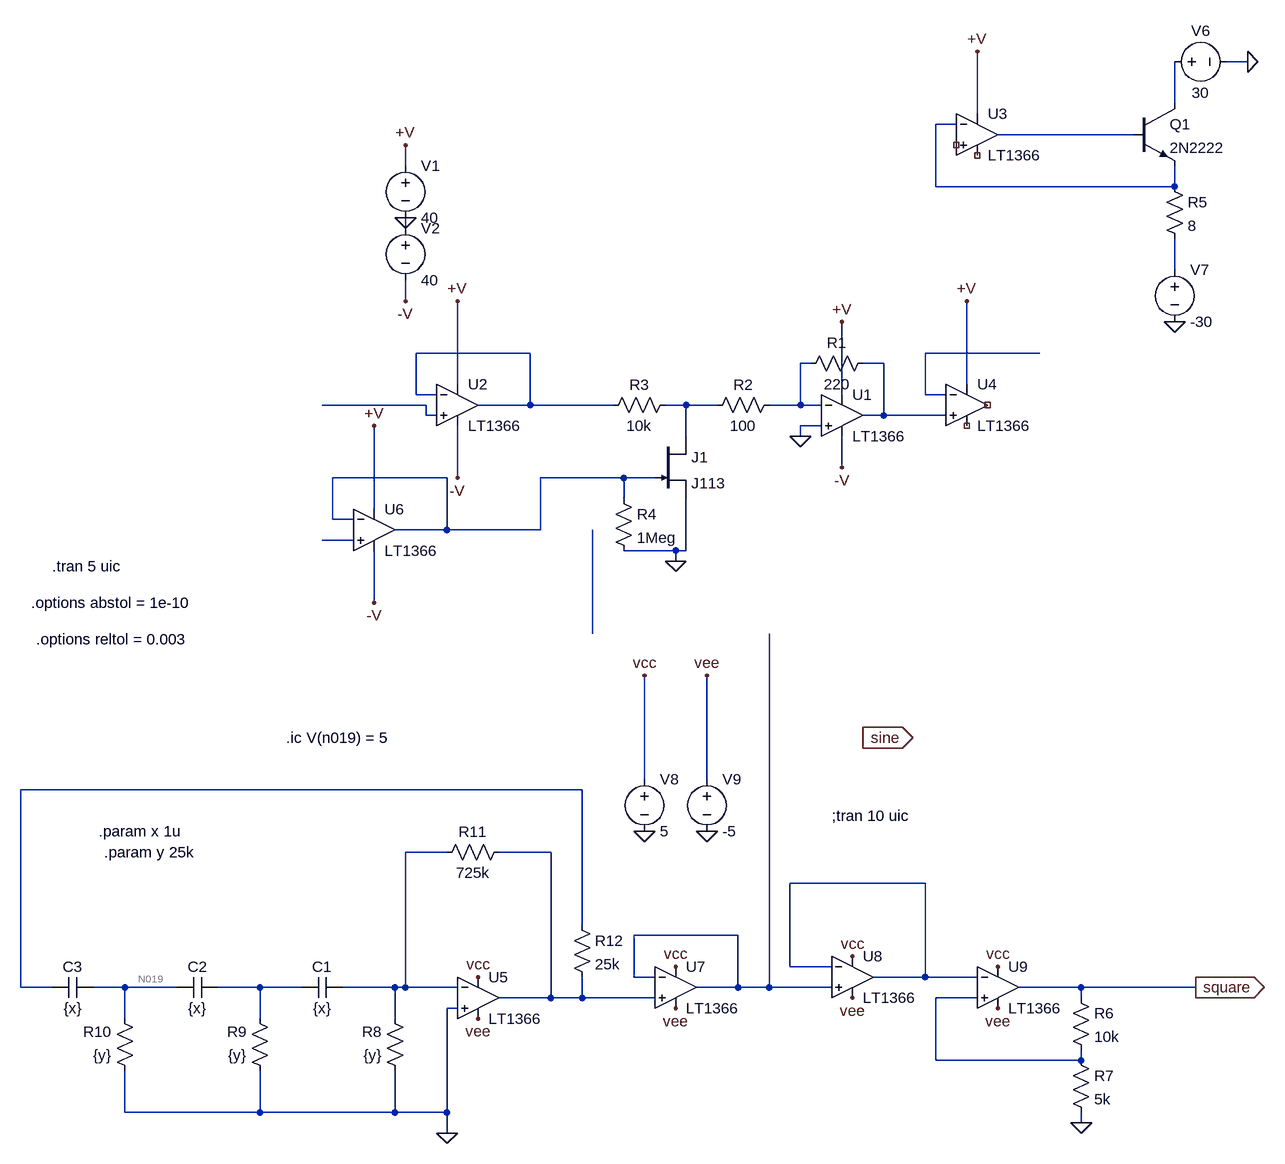
[diagram p0: schematic VCATest-CurrentAmp.asc]
VCATest-CurrentAmp.asc, the LTspice schematic file:
Version 4
SHEET 1 2992 1356
WIRE 592 -432 560 -432
WIRE 480 -368 480 -432
WIRE 176 -352 176 -448
WIRE 144 -336 112 -336
WIRE 416 -320 208 -320
WIRE -704 -272 -704 -304
WIRE 112 -240 112 -336
WIRE 480 -240 480 -272
WIRE 480 -240 112 -240
WIRE -704 -176 -704 -192
WIRE 480 -112 480 -160
WIRE -704 -64 -704 -96
WIRE -512 16 -688 16
WIRE 272 16 96 16
WIRE -80 32 -96 32
WIRE 32 32 0 32
WIRE -624 64 -624 -64
WIRE 160 64 160 -64
WIRE -688 80 -688 16
WIRE -656 80 -688 80
WIRE -32 80 -32 -32
WIRE 96 80 96 16
WIRE 128 80 96 80
WIRE -672 96 -832 96
WIRE -512 96 -512 16
WIRE -512 96 -592 96
WIRE -384 96 -512 96
WIRE -272 96 -304 96
WIRE -224 96 -272 96
WIRE -96 96 -96 32
WIRE -96 96 -144 96
WIRE -64 96 -96 96
WIRE -672 112 -672 96
WIRE -656 112 -672 112
WIRE 32 112 32 32
WIRE 32 112 0 112
WIRE 128 112 32 112
WIRE -64 128 -96 128
WIRE -272 144 -272 96
WIRE -96 144 -96 128
WIRE -32 192 -32 144
WIRE -640 208 -816 208
WIRE -624 208 -624 128
WIRE -368 208 -496 208
WIRE -320 208 -368 208
WIRE -368 240 -368 208
WIRE -752 256 -752 128
WIRE -816 272 -816 208
WIRE -784 272 -816 272
WIRE -640 288 -640 208
WIRE -640 288 -720 288
WIRE -496 288 -496 208
WIRE -496 288 -640 288
WIRE -784 304 -832 304
WIRE -288 320 -368 320
WIRE -272 320 -272 240
WIRE -272 320 -288 320
WIRE -288 336 -288 320
WIRE -752 400 -752 320
WIRE -416 448 -416 288
WIRE -336 672 -336 512
WIRE -240 672 -240 512
WIRE -432 688 -1296 688
WIRE -640 784 -704 784
WIRE -480 784 -560 784
WIRE 96 832 -112 832
WIRE -432 896 -432 688
WIRE -192 912 -352 912
WIRE -112 960 -112 832
WIRE -48 960 -112 960
WIRE -352 976 -352 912
WIRE -320 976 -352 976
WIRE 96 976 96 832
WIRE 96 976 16 976
WIRE 176 976 96 976
WIRE -1296 992 -1296 688
WIRE -1248 992 -1296 992
WIRE -1136 992 -1184 992
WIRE -1056 992 -1136 992
WIRE -928 992 -992 992
WIRE -864 992 -928 992
WIRE -720 992 -800 992
WIRE -704 992 -704 784
WIRE -704 992 -720 992
WIRE -624 992 -704 992
WIRE -192 992 -192 912
WIRE -192 992 -256 992
WIRE -144 992 -144 448
WIRE -144 992 -192 992
WIRE -48 992 -144 992
WIRE 336 992 240 992
WIRE 512 992 336 992
WIRE -480 1008 -480 784
WIRE -480 1008 -560 1008
WIRE -432 1008 -432 976
WIRE -432 1008 -480 1008
WIRE -320 1008 -432 1008
WIRE 176 1008 112 1008
WIRE 336 1008 336 992
WIRE -624 1024 -640 1024
WIRE -1136 1040 -1136 992
WIRE -928 1040 -928 992
WIRE -720 1040 -720 992
WIRE 112 1104 112 1008
WIRE 336 1104 336 1088
WIRE 336 1104 112 1104
WIRE -1136 1184 -1136 1120
WIRE -928 1184 -928 1120
WIRE -928 1184 -1136 1184
WIRE -720 1184 -720 1120
WIRE -720 1184 -928 1184
WIRE -640 1184 -640 1024
WIRE -640 1184 -720 1184
WIRE 336 1200 336 1184
WIRE -640 1216 -640 1184
FLAG -32 -32 +V
FLAG -32 192 -V
FLAG -96 144 0
FLAG -288 336 0
FLAG -704 -192 0
FLAG -704 -304 +V
FLAG -704 -64 -V
FLAG -624 -64 +V
FLAG -624 208 -V
FLAG 176 -448 +V
FLAG 160 -64 +V
FLAG 592 -432 0
FLAG -752 128 +V
FLAG -752 400 -V
FLAG 480 -32 0
FLAG 336 1200 0
FLAG 512 992 square
IOPIN 512 992 Out
FLAG -640 1216 0
FLAG -240 752 0
FLAG -336 752 0
FLAG -336 512 vcc
FLAG -240 512 vee
FLAG -592 976 vcc
FLAG -288 960 vcc
FLAG -592 1040 vee
FLAG -288 1024 vee
FLAG 0 608 sine
IOPIN 0 608 Out
FLAG -16 944 vcc
FLAG 208 960 vcc
FLAG -16 1008 vee
FLAG 208 1024 vee
SYMBOL Opamps\\LT1366 -32 48 R0
SYMATTR InstName U1
SYMBOL res 16 16 R90
WINDOW 0 0 56 VBottom 2
WINDOW 3 32 56 VTop 2
SYMATTR InstName R1
SYMATTR Value 220
SYMBOL res -128 80 R90
WINDOW 0 0 56 VBottom 2
WINDOW 3 32 56 VTop 2
SYMATTR InstName R2
SYMATTR Value 100
SYMBOL res -288 80 R90
WINDOW 0 0 56 VBottom 2
WINDOW 3 32 56 VTop 2
SYMATTR InstName R3
SYMATTR Value 10k
SYMBOL njf -320 144 R0
SYMATTR InstName J1
SYMATTR Value J113
SYMBOL res -384 224 R0
SYMATTR InstName R4
SYMATTR Value 1Meg
SYMBOL voltage -704 -288 R0
WINDOW 123 0 0 Left 0
WINDOW 39 0 0 Left 0
SYMATTR InstName V1
SYMATTR Value 40
SYMBOL voltage -704 -192 R0
WINDOW 123 0 0 Left 0
WINDOW 39 0 0 Left 0
SYMATTR InstName V2
SYMATTR Value 40
SYMBOL Opamps\\LT1366 -624 32 R0
SYMATTR InstName U2
SYMBOL res 464 -256 R0
SYMATTR InstName R5
SYMATTR Value 8
SYMBOL npn 416 -368 R0
SYMATTR InstName Q1
SYMATTR Value 2N2222
SYMBOL Opamps\\LT1366 160 32 R0
SYMATTR InstName U4
SYMBOL voltage 464 -432 R270
WINDOW 0 32 56 VTop 2
WINDOW 3 -32 56 VBottom 2
WINDOW 123 0 0 Left 0
WINDOW 39 0 0 Left 0
SYMATTR InstName V6
SYMATTR Value 30
SYMBOL Opamps\\LT1366 176 -384 R0
SYMATTR InstName U3
SYMBOL Opamps\\LT1366 -752 224 R0
SYMATTR InstName U6
SYMBOL voltage 480 -128 R0
WINDOW 123 0 0 Left 0
WINDOW 39 0 0 Left 0
SYMATTR InstName V7
SYMATTR Value -30
SYMBOL res 320 992 R0
SYMATTR InstName R6
SYMATTR Value 10k
SYMBOL res 320 1088 R0
SYMATTR InstName R7
SYMATTR Value 5k
SYMBOL cap -800 976 R90
WINDOW 0 0 32 VBottom 2
WINDOW 3 32 32 VTop 2
SYMATTR InstName C1
SYMATTR Value {x}
SYMBOL cap -992 976 R90
WINDOW 0 0 32 VBottom 2
WINDOW 3 32 32 VTop 2
SYMATTR InstName C2
SYMATTR Value {x}
SYMBOL cap -1184 976 R90
WINDOW 0 0 32 VBottom 2
WINDOW 3 32 32 VTop 2
SYMATTR InstName C3
SYMATTR Value {x}
SYMBOL res -704 1136 R180
WINDOW 0 36 76 Left 2
WINDOW 3 36 40 Left 2
SYMATTR InstName R8
SYMATTR Value {y}
SYMBOL res -912 1136 R180
WINDOW 0 36 76 Left 2
WINDOW 3 36 40 Left 2
SYMATTR InstName R9
SYMATTR Value {y}
SYMBOL res -1120 1136 R180
WINDOW 0 36 76 Left 2
WINDOW 3 36 40 Left 2
SYMATTR InstName R10
SYMATTR Value {y}
SYMBOL res -656 800 R270
WINDOW 0 32 56 VTop 2
WINDOW 3 0 56 VBottom 2
SYMATTR InstName R11
SYMATTR Value 725k
SYMBOL Opamps/LT1366 -592 944 R0
SYMATTR InstName U5
SYMBOL Opamps/LT1366 -288 928 R0
SYMATTR InstName U7
SYMBOL voltage -336 656 R0
SYMATTR InstName V8
SYMATTR Value 5
SYMBOL voltage -240 656 R0
SYMATTR InstName V9
SYMATTR Value -5
SYMBOL Opamps/LT1366 -16 912 R0
SYMATTR InstName U8
SYMBOL Opamps/LT1366 208 928 R0
SYMATTR InstName U9
SYMBOL res -448 880 R0
SYMATTR InstName R12
SYMATTR Value 25k
TEXT -1248 344 Left 2 !.tran 5 uic
TEXT -1280 400 Left 2 !.options abstol = 1e-10
TEXT -1272 456 Left 2 !.options reltol = 0.003
TEXT -48 728 Left 2 !;tran 10 uic
TEXT -1176 752 Left 2 !.param x 1u
TEXT -1168 784 Left 2 !.param y 25k
TEXT -888 608 Left 2 !.ic V(n019) = 5

The netlist it stands for:
* VCATest-CurrentAmp.asc
XU1 0 N007 +V -V N008 LT1366  ; pins In+ In- V+ V- OUT
R1 N008 N007 220
R2 N007 N010 100
R3 N010 N005 10k
J1 N010 N011 0 J113
R4 N011 0 1Meg
V1 +V 0 40
V2 0 -V 40
XU2 N009 N005 +V -V N005 LT1366  ; pins In+ In- V+ V- OUT
R5 N002 N004 8
Q1 N001 N003 N002 0 2N2222
XU4 N008 N006 +V NC_01 NC_02 LT1366  ; pins In+ In- V+ V- OUT
V6 N001 0 30
XU3 NC_03 N002 +V NC_04 N003 LT1366  ; pins In+ In- V+ V- OUT
XU6 N012 N011 +V -V N011 LT1366  ; pins In+ In- V+ V- OUT
V7 N004 0 -30
R6 square N021 10k
R7 N021 0 5k
C1 N015 N020 {x}
C2 N020 N019 {x}
C3 N019 N014 {x}
R8 0 N015 {y}
R9 0 N020 {y}
R10 0 N019 {y}
R11 N015 N016 725k
XU5 0 N015 vcc vee N016 LT1366  ; pins In+ In- V+ V- OUT
XU7 N016 N018 vcc vee N018 LT1366  ; pins In+ In- V+ V- OUT
V8 vcc 0 5
V9 vee 0 -5
XU8 N018 N017 vcc vee N017 LT1366  ; pins In+ In- V+ V- OUT
XU9 N021 N017 vcc vee square LT1366  ; pins In+ In- V+ V- OUT
R12 N014 N016 25k
.model NPN NPN
.model PNP PNP
.lib standard.bjt
.model NJF NJF
.model PJF PJF
.lib standard.jft
.tran 5 uic
.options abstol = 1e-10
.options reltol = 0.003
;tran 10 uic
.param x 1u
.param y 25k
.ic V(n019) = 5
.lib LTC.lib
.backanno
.end